# EAGLE design untitled (EAGLE 6.4)
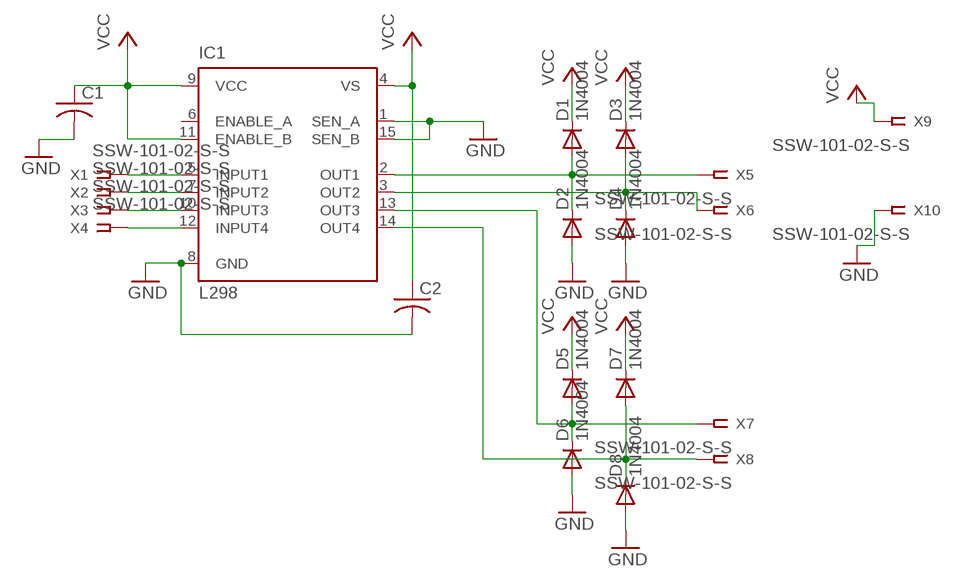
[diagram p0: schematic, sheet 1]

## Parts
C1  C-US025-025X050  [C025-025X050]
C2  C-US025-025X050  [C025-025X050]
D1  1N4004  [DO41-10]
D2  1N4004  [DO41-10]
D3  1N4004  [DO41-10]
D4  1N4004  [DO41-10]
D5  1N4004  [DO41-10]
D6  1N4004  [DO41-10]
D7  1N4004  [DO41-10]
D8  1N4004  [DO41-10]
IC1  L298  [MULTIWATT-15]
X1  SSW-101-02-S-S  [SSW-101-02-S-S]
X2  SSW-101-02-S-S  [SSW-101-02-S-S]
X3  SSW-101-02-S-S  [SSW-101-02-S-S]
X4  SSW-101-02-S-S  [SSW-101-02-S-S]
X5  SSW-101-02-S-S  [SSW-101-02-S-S]
X6  SSW-101-02-S-S  [SSW-101-02-S-S]
X7  SSW-101-02-S-S  [SSW-101-02-S-S]
X8  SSW-101-02-S-S  [SSW-101-02-S-S]
X9  SSW-101-02-S-S  [SSW-101-02-S-S]
X10  SSW-101-02-S-S  [SSW-101-02-S-S]

## Nets
GND: C1.2 C2.2 D2.A D4.A D6.A D8.A IC1.1(SEN_A) IC1.8(GND) IC1.15(SEN_B) X10.1
N$1: IC1.5(INPUT1) X1.1
N$2: IC1.7(INPUT2) X2.1
N$3: IC1.10(INPUT3) X3.1
N$4: IC1.12(INPUT4) X4.1
N$5: D1.A D2.C IC1.2(OUT1) X5.1
N$7: D3.A D4.C IC1.3(OUT2) X6.1
N$9: D5.A D6.C IC1.13(OUT3) X7.1
N$11: D7.A D8.C IC1.14(OUT4) X8.1
VCC: C1.1 C2.1 D1.C D3.C D5.C D7.C IC1.4(VS) IC1.9(VCC) IC1.11(ENABLE_B) X9.1
Unconnected: IC1.6(ENABLE_A)

## Library data of the parts
C1 C2 = rcl:C-US: CAPACITOR, American symbol
D1-D8 = diode:1N4004: DIODE general purpose rectifier, 1 A
IC1 = st-microelectronics:L298: DUAL FULL-BRIDGE DRIVER; MPN: L298N; OC_FARNELL: 1589425; OC_NEWARK: 32M1527
X1-X10 = con-samtec:SSW-101-02-S-S: THROUGH-HOLE .025" SQ POST SOCKET Source: Samtec SSW.pdf; MPN: SSW-101-02-S-S; OC_FARNELL: unknown; OC_NEWARK: 11P9336

## Board
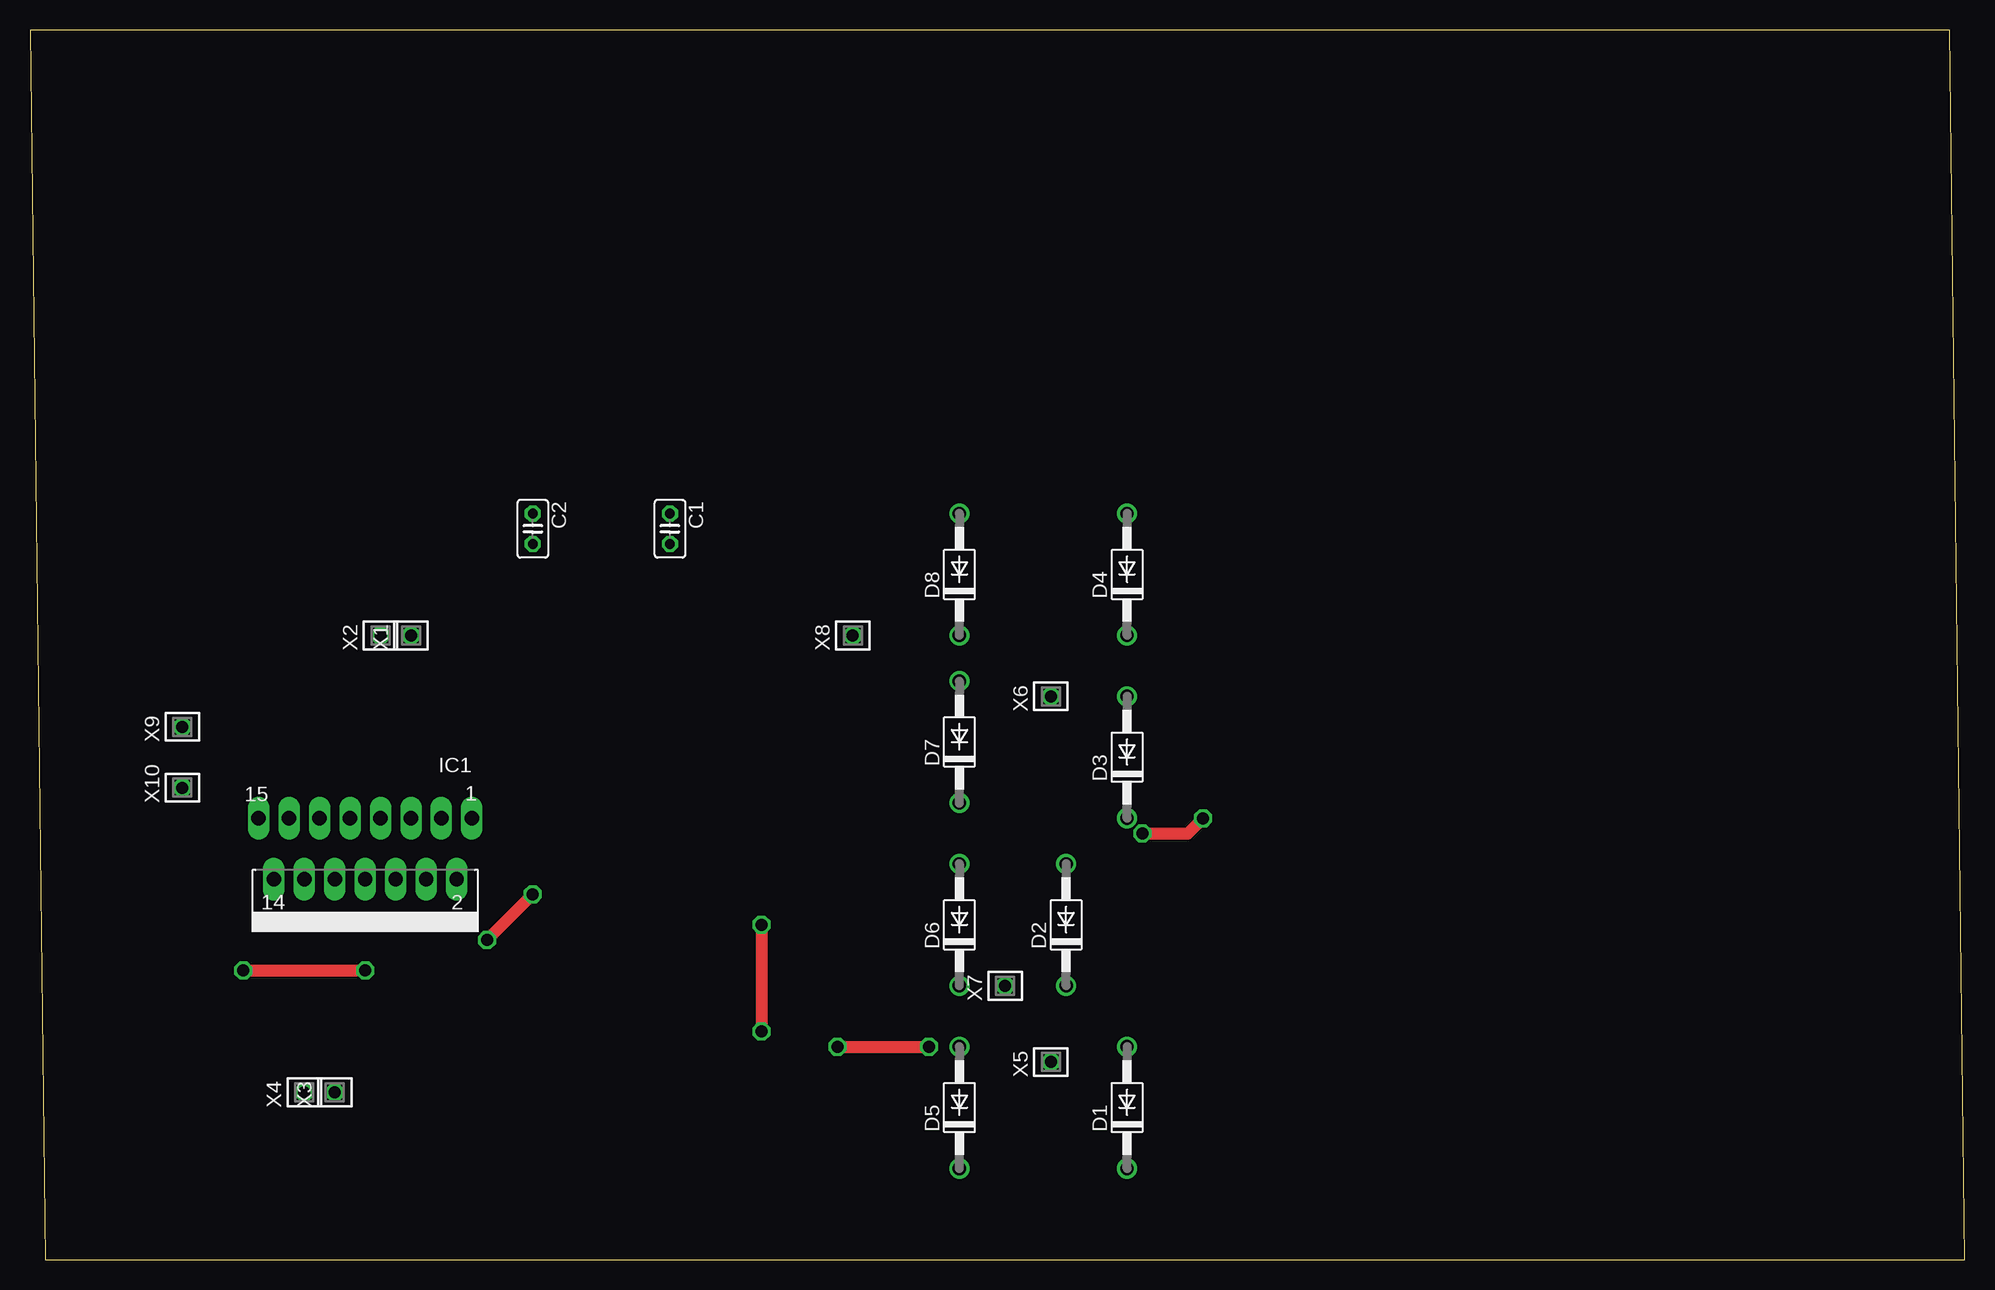
[diagram p1: board, top side]
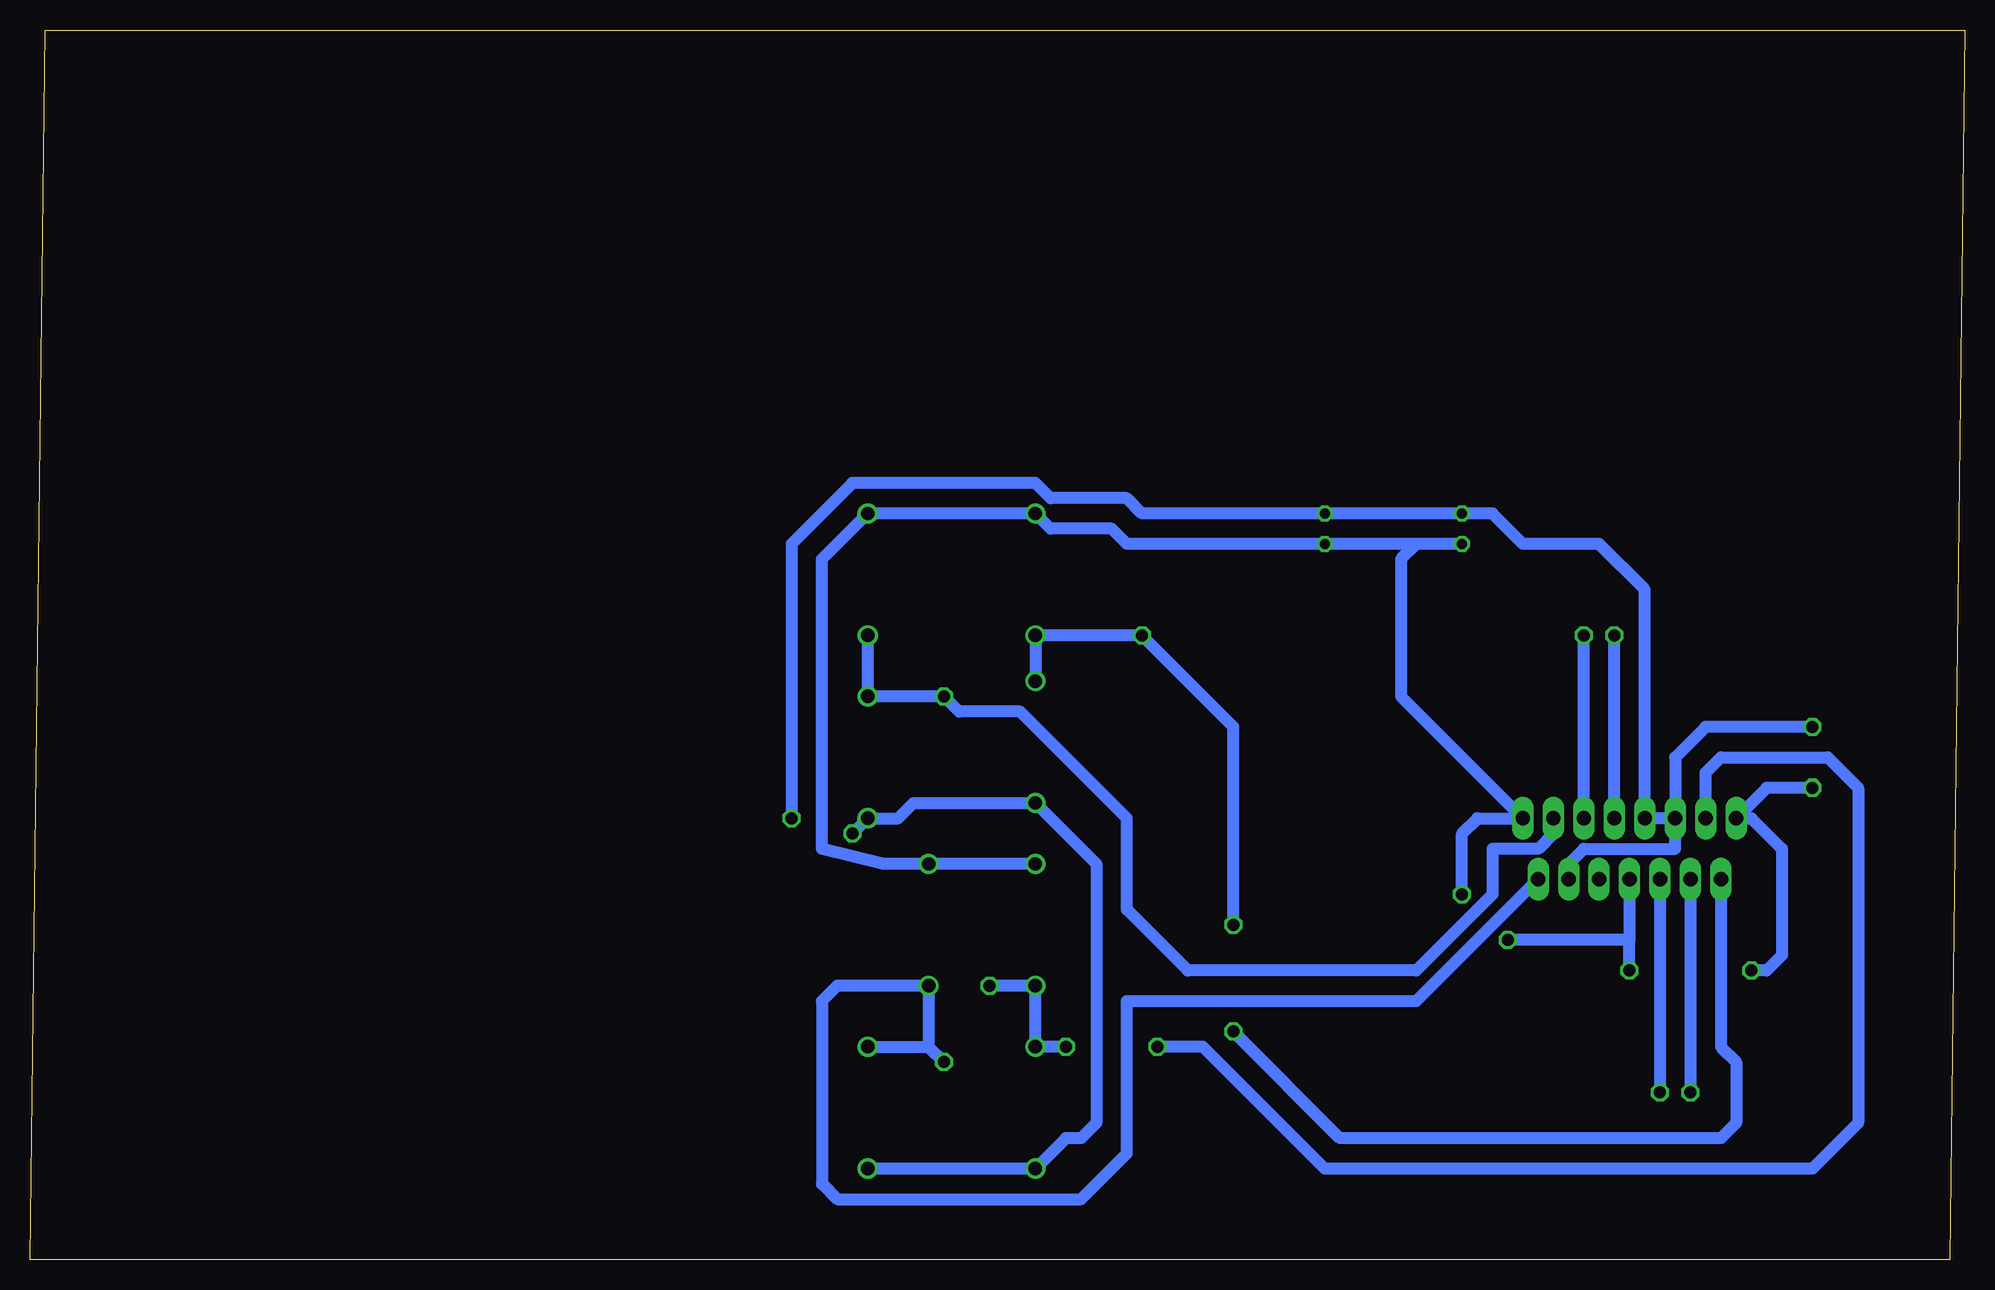
[diagram p2: board, bottom side, seen from below]

Size 161.27 x 102.54 mm. Coordinates in mm from the lower left corner, seen from the top.
Outline: 1.27,0 161.27,0 160,102.54 0,102.54 1.27,0
Copper layers (1*16): Top 0.035mm / dielectric 1.5mm / Bottom 0.035mm
Design rules "default": minimum track width 10mil, minimum drill 24mil, track to track 8mil, track to pad 8mil, pad to pad 8mil, via to via 8mil, smd to smd 8mil, copper to edge 40mil, drill to drill 8mil, minimum pad ring 10mil, minimum via ring 8mil, stop-mask expansion 4mil, vias tented up to drill 0mil, thermal gap 10mil

### Footprints (pad centres in the part's own frame; a part is rotated, then mirrored left to right if it is on the bottom)
C025-025X050 = drill 0.813 octagon: 1 -1.27,0; 2 1.27,0
DO41-10 = drill 1.118: A 5.08,0; C -5.08,0
MULTIWATT-15 = drill 1.2 long: 1 -8.89,-7.62; 2 -7.62,-2.54; 3 -6.35,-7.62; 4 -5.08,-2.54; 5 -3.81,-7.62; 6 -2.54,-2.54; 7 -1.27,-7.62; 8 0,-2.54; 9 1.27,-7.62; 10 2.54,-2.54; 11 3.81,-7.62; 12 5.08,-2.54; 13 6.35,-7.62; 14 7.62,-2.54; 15 8.89,-7.62
SSW-101-02-S-S = drill 1 pad 1.5 octagon: 1 0,0

### Placement (x,y rotation side)
C1  53.34,60.96 270 top
C2  41.91,60.96 270 top
D1  91.44,12.7 90 top
D2  86.36,27.94 90 top
D3  91.44,41.91 90 top
D4  91.44,57.15 90 top
D5  77.47,12.7 90 top
D6  77.47,27.94 90 top
D7  77.47,43.18 90 top
D8  77.47,57.15 90 top
IC1  27.94,29.21 180 top
X1  31.75,52.07 0 top
X2  29.21,52.07 0 top
X3  25.4,13.97 0 top
X4  22.86,13.97 0 top
X5  85.09,16.51 0 top
X6  85.09,46.99 0 top
X7  81.28,22.86 0 top
X8  68.58,52.07 0 top
X9  12.7,44.45 0 top
X10  12.7,39.37 0 top

### Tracks (layer width: path | path; a pad name or v marks a point on that pad's centre or on a via)
GND  (via drill 1)
  Top 1.016: v17.78,24.13 v27.94,24.13 | v38.1,26.67 v41.91,30.48
  Bottom 1.016: X10.1 16.51,39.37 IC1.15 17.78,36.83 15.24,34.29 15.24,25.4 16.51,24.13 v17.78,24.13 | 45.72,59.69 C1.2 69.85,59.69 71.12,60.96 76.2,60.96 D8.A D4.A 95.25,58.42 95.25,34.29 90.17,33.02 D6.A D2.A | C2.2 45.72,59.69 | 45.72,59.69 46.99,58.42 46.99,46.99 IC1.1 40.64,36.83 41.91,35.56 v41.91,30.48 | v27.94,24.13 27.94,26.67 | IC1.8 27.94,26.67 | 27.94,26.67 v38.1,26.67
N$1
  Bottom 1.016: IC1.5 X1.1
N$2
  Bottom 1.016: IC1.7 X2.1
N$3
  Bottom 1.016: IC1.10 X3.1
N$4
  Bottom 1.016: IC1.12 X4.1
N$5
  Bottom 1.016: D1.A 86.36,17.78 | 86.36,17.78 X5.1 | 86.36,17.78 D2.C 93.98,22.86 95.25,21.59 95.25,6.35 93.98,5.08 73.66,5.08 69.85,8.89 69.85,21.59 45.72,21.59 IC1.2
N$7
  Bottom 1.016: D4.C D3.A X6.1 83.82,45.72 78.74,45.72 69.85,36.83 69.85,29.21 64.77,24.13 45.72,24.13 39.37,30.48 39.37,34.29 35.56,34.29 34.29,35.56 IC1.3
N$9  (via drill 1)
  Top 1.016: v67.31,17.78 v74.93,17.78
  Bottom 1.016: X7.1 D6.C D5.A v74.93,17.78 | IC1.13 21.59,40.64 20.32,41.91 11.43,41.91 8.89,39.37 8.89,11.43 12.7,7.62 53.34,7.62 63.5,17.78 v67.31,17.78
N$11  (via drill 1)
  Top 1.016: v60.96,27.94 v60.96,19.05
  Bottom 1.016: D7.A D8.C X8.1 60.96,44.45 v60.96,27.94 | IC1.14 20.32,17.78 19.05,16.51 19.05,11.43 20.32,10.16 52.07,10.16 v60.96,19.05
VCC  (via drill 1)
  Top 1.016: v92.71,35.56 96.52,35.56 v97.79,36.83
  Bottom 1.016: X9.1 21.59,44.45 24.13,41.91 IC1.11 | IC1.11 IC1.9 26.67,55.88 30.48,59.69 36.83,59.69 39.37,62.23 C2.1 C1.1 68.58,62.23 69.85,63.5 76.2,63.5 77.47,64.77 92.71,64.77 97.79,59.69 v97.79,36.83 | D1.C D5.C 74.93,10.16 73.66,10.16 72.39,11.43 72.39,33.02 D7.C 87.63,38.1 88.9,36.83 D3.C v92.71,35.56 | IC1.4 33.02,33.02 31.75,34.29 24.13,34.29 IC1.11